# EAGLE design ver1 (EAGLE 6.1)
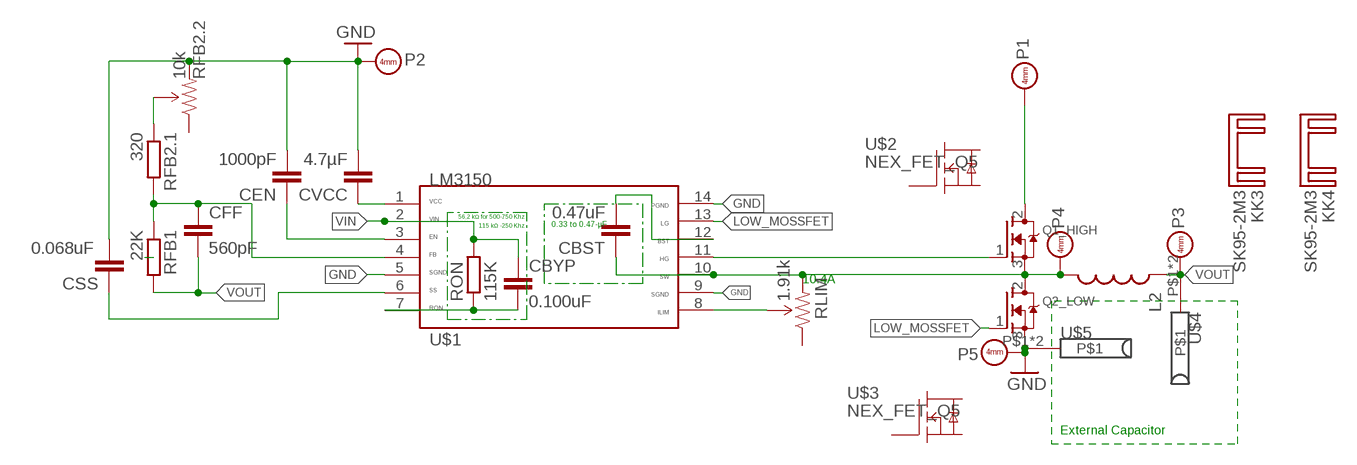
[diagram p0: schematic, sheet 1]

## Parts
CBST  0.47uF  C0805  [0805]
CBYP  0.100uF  C0805  [0805]
CEN  1000pF  C0805  [0805]
CFF  560pF  C0805  [0805]
CSS  0.068uF  C0805  [0805]
CVCC  4.7µF  C0805  [0805]
KK3  SK95-2M3  [SK95-2M3]
KK4  SK95-2M3  [SK95-2M3]
L2  INDUCTOR  [INDUCTOR-SRP4020]
P1  BANANA  [BANANA]
P2  BANANA  [BANANA]
P3  BANANA  [BANANA]
P4  BANANA  [BANANA]
P5  BANANA  [BANANA]
Q1_HIGH  MOSFET-NGDS_TO220V  [TO220V]
Q2_LOW  MOSFET-NGDS_TO220V  [TO220V]
RFB1  22K  RESISTORR805-0805  [R805]
RFB2.1  320  RESISTORR805-0805  [R805]
RFB2.2  10k  TRIMPOT3362U-2  [3362U-2]
RLIM  1.91k  TRIMPOT3362U-2  [3362U-2]
RON  115K  RESISTORR805-0805  [R805]
U$1  LM3150  [HTSSOP14]
U$2  NEX_FET_Q5  [Q5]
U$3  NEX_FET_Q5  [Q5]
U$4  BANANA  [BANANA]
U$5  BANANA  [BANANA]

## Nets
GND: CEN.2 CSS.2 CVCC.2 P2.P$1 P5.P$1 Q2_LOW.3(S) RFB2.2.3(CW) U$1.5 U$1.9 U$1.14 U$5.P$1 U$5.P$2
HIGH_MOSSFET: Q1_HIGH.1(G) U$1.11
LOW_MOSSFET: Q2_LOW.1(G) U$1.13
N$1: CVCC.1 U$1.1
N$2: CBYP.2 RON.1 U$1.7
N$3: CEN.1 U$1.3
N$4: CSS.1 U$1.6
N$5: CFF.1 RFB1.1 RFB2.1.2 U$1.4
N$6: RFB2.1.1 RFB2.2.2(WIPER)
N$7: CBST.2 U$1.12
N$11: RLIM.2(WIPER) U$1.8
N$13: CBST.1 L2.P$2 P4.P$1 Q1_HIGH.3(S) Q2_LOW.2(D) RLIM.3(CW) U$1.10
VIN: CBYP.1 P1.P$1 Q1_HIGH.2(D) RON.2 U$1.2
VOUT: CFF.2 L2.P$1 P3.P$1 RFB1.2
Unconnected: RFB2.2.1(CCW) RLIM.1(CCW) U$2.P$1(S) U$2.P$2(S) U$2.P$3(S) U$2.P$4(G) U$2.P$5(D) U$2.P$6(D) U$2.P$7(D) U$2.P$8(D) U$3.P$1(S) U$3.P$2(S) U$3.P$3(S) U$3.P$4(G) U$3.P$5(D) U$3.P$6(D) U$3.P$7(D) U$3.P$8(D) U$4.P$1 U$4.P$2

## Notes on the sheet
- 56,2 kΩ for 500-750 Khz
- 0.33 to 0.47-µF
- 115 kΩ -250 Khz
- 10.4A
- External Capacitor

## Library data of the parts
CBST CBYP CEN CFF CSS CVCC = adi_v1.6:C: SMD capacitor 0603 0805 1206
KK3 KK4 = heatsink:SK95-2M3: HEATSINK manufacturer Fischer/distributor Buerklin
L2 = SparkFun-Passives:INDUCTOR: Inductors Basic Inductor/Choke - 0603 and 1206. Footprints are not proven and vary greatly between part numbers. INDUCTOR POWER 3.3UH 4.0A SMD 0.197" L x 0.197" W x 0.177" H (5.00mm x 5.00mm x 4.50mm)
P1-P5 = adi_v1.6:BANANA
Q1_HIGH Q2_LOW = adafruit:MOSFET-N: N-Channel Mosfet 2N7002E - 60V 260mA SOT23 [Digikey: 2N7002ET1GOSTR-ND] - REEL BSH103 - 30V 850mA SOT23 [Digikey: 568-5013-1-ND]
RFB1 RFB2.1 RON = dp_devices:RESISTOR
RFB2.2 RLIM = SparkFun-Electromechanical:TRIMPOT: Various small potentiometers for "set-and-forget" applications
U$1 = TI_MSP430_v16:LM3150
U$2 U$3 = Serghei IR station:NEX_FET_Q5
U$4 U$5 = H_bridge_library:BANANA

## Board
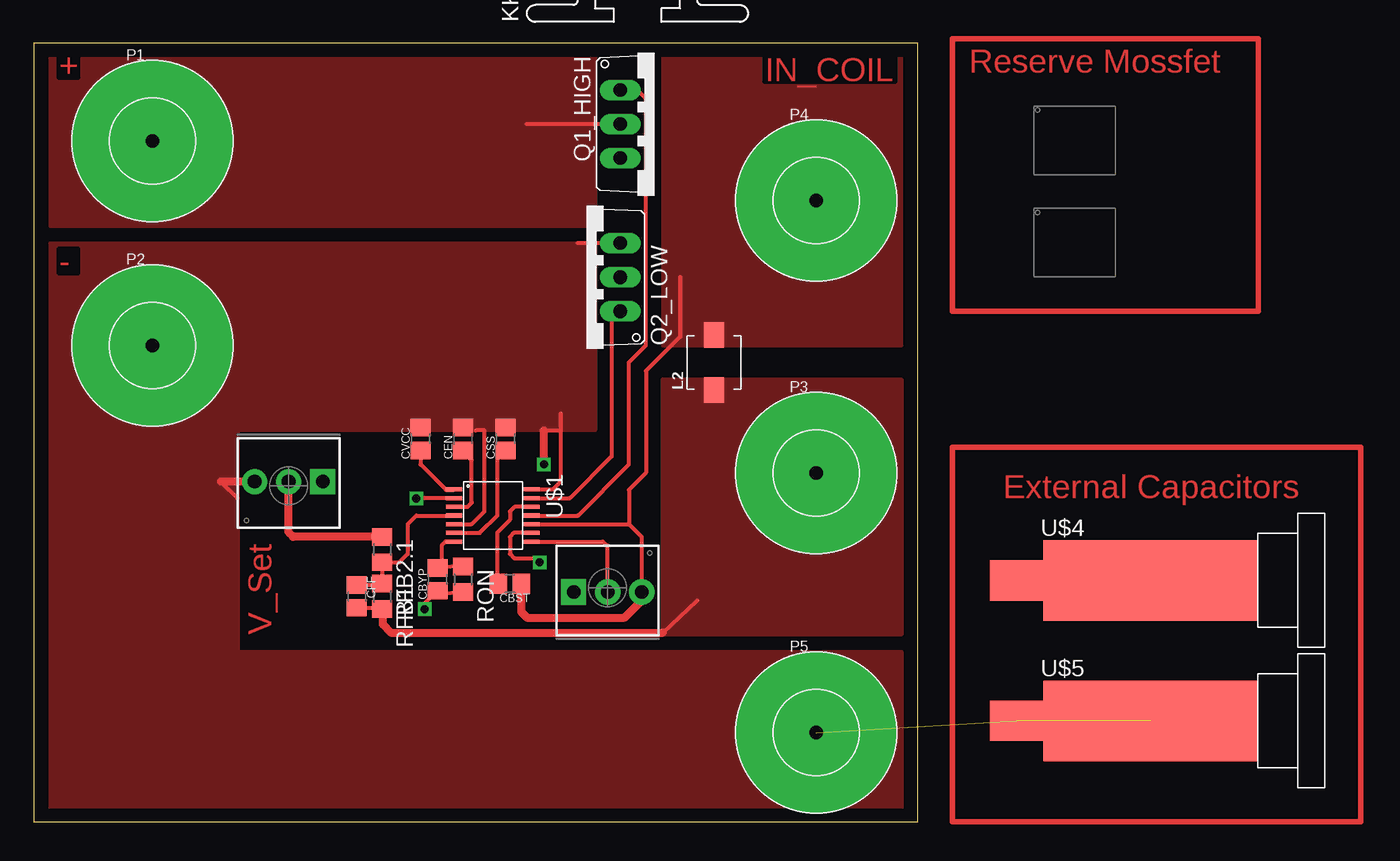
[diagram p1: board, top side]
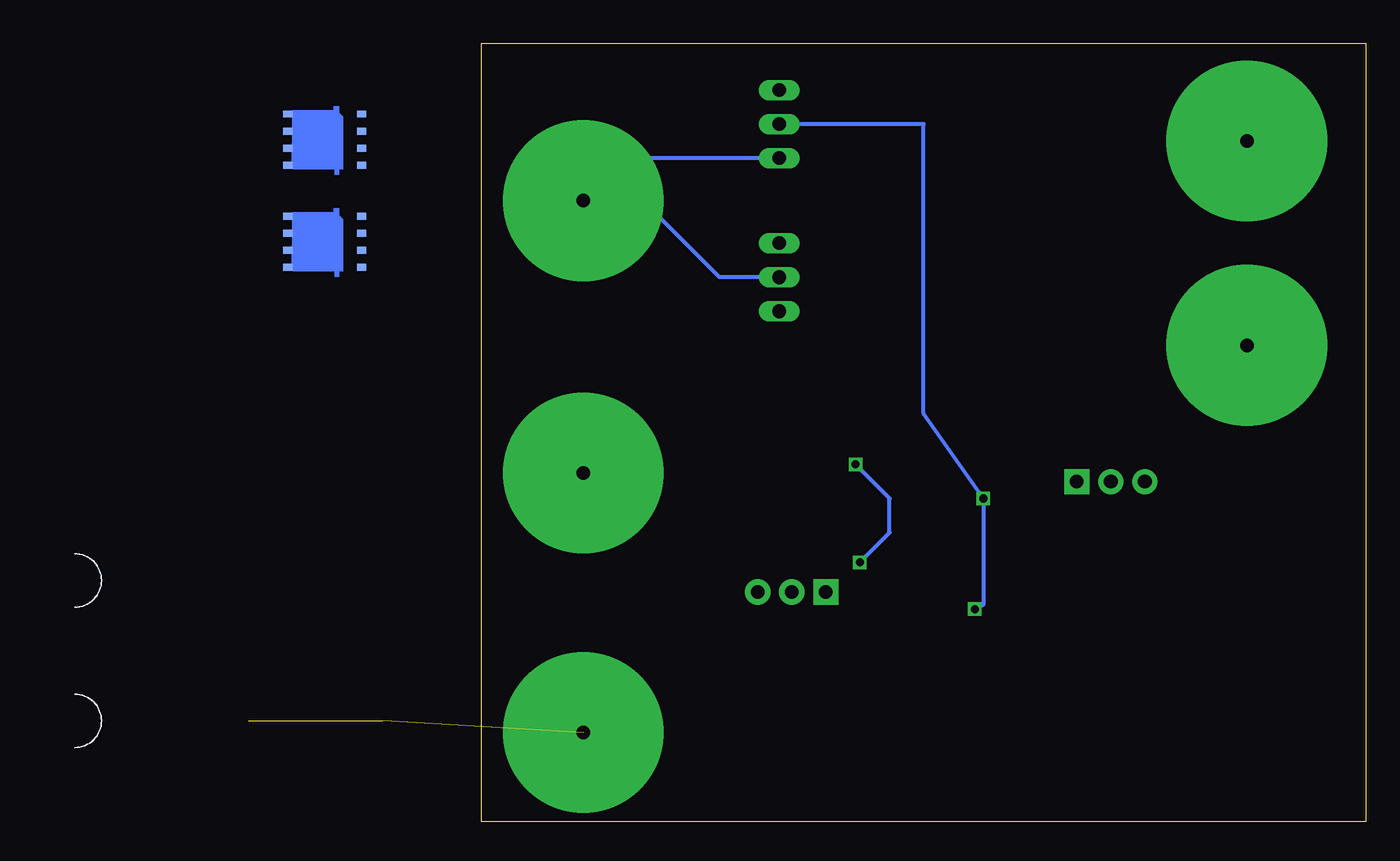
[diagram p2: board, bottom side, seen from below]

Size 66.02 x 58.09 mm. Coordinates in mm from the lower left corner, seen from the top.
Outline: 0,0 66.02,0 66.02,58.09 0,58.09 0,0
Copper layers (1*16): Top 0.035mm / dielectric 1.5mm / Bottom 0.035mm
Design rules: minimum track width 10mil, minimum drill 24mil, track to track 8mil, track to pad 8mil, pad to pad 8mil, via to via 8mil, smd to smd 8mil, copper to edge 40mil, drill to drill 8mil, minimum pad ring 10mil, minimum via ring 8mil, stop-mask expansion 4mil, vias tented up to drill 0mil, thermal gap 10mil

### Footprints (pad centres in the part's own frame; a part is rotated, then mirrored left to right if it is on the bottom)
0805 = smd 1.3 x 1.5: 1 -0.85,0; 2 0.85,0
SK95-2M3 = hole 3.302: 0,2.54
INDUCTOR-SRP4020 = smd 1.9 x 1.5: P$1 -2.05,0; P$2 2.05,0
BANANA = drill 1 pad 12: P$1 0,0
TO220V = drill 1.016 long: 1 -2.54,-2.54; 2 0,-2.54; 3 2.54,-2.54
R805 = smd 1.3 x 1.5: 1 -0.95,0; 2 0.95,0
3362U-2 = drill 1.016 pad 1.88 square: 1 -2.54,-0.305 | drill 1.016 pad 1.88: 2 0,-0.305; 3 2.54,-0.305
HTSSOP14 = smd 0.3 x 1.2: 1 -1.95,-2.9; 2 -1.3,-2.9; 3 -0.65,-2.9; 4 0,-2.9; 5 0.65,-2.9; 6 1.3,-2.9; 7 1.95,-2.9; 8 1.95,2.9; 9 1.3,2.9; 10 0.65,2.9; 11 0,2.9; 12 -0.65,2.9; 13 -1.3,2.9; 14 -1.95,2.9
Q5 = smd 0.7 x 0.5 bottom: P$1 -2.5,2.01; P$2 -2.5,0.74; P$3 -2.5,-0.53; P$4 -2.5,-1.8; P$5 3,-1.8; P$6 3,-0.53; P$7 3,0.74; P$8 3,2.01
BANANA' = smd 16 x 6: P$1 0.84,-0.08 | smd 4 x 3: P$2 -9.16,-0.08

### Placement (x,y rotation side)
CBST  35.56,17.78 180 top
CBYP  30.16,18.1 90 top
CEN  32.07,28.57 90 top
CFF  24.13,16.83 270 top
CSS  35.24,28.57 90 top
CVCC  28.89,28.57 90 top
KK3  48.26,66.04 270 top  (outside the outline)
KK4  41.91,66.04 90 top  (outside the outline)
L2  50.8,34.29 90 top
P1  8.89,50.8 0 top
P2  8.89,35.56 0 top
P3  58.42,26.04 0 top
P4  58.42,46.35 0 top
P5  58.42,6.67 0 top
Q1_HIGH  46.35,52.07 270 top
Q2_LOW  41.27,40.64 90 top
RFB1  26.04,16.83 270 top
RFB2.1  26.04,20.32 270 top
RFB2.2  19.05,25.08 180 top
RLIM  42.86,17.46 0 top
RON  32.07,18.1 270 top
U$1  34.29,22.86 270 top
U$2  77.47,43.18 0 top  (outside the outline)
U$3  77.47,50.8 0 top  (outside the outline)
U$4  BANANA  [BANANA']  82.55,18.1 0 top  (outside the outline)
U$5  BANANA  [BANANA']  82.55,7.62 0 top  (outside the outline)

### Tracks (layer width: path | path; a pad name or v marks a point on that pad's centre or on a via)
GND  (via drill 0.6)  (2 unrouted)
  Top 0.305: U$1.14 38.78,24.81 39.37,25.4 39.37,29.21 | 39.37,29.21 39.37,30.48 | U$1.5 32.69,22.21 33.66,23.18 33.66,29.21 33.02,29.21 | 13.98,25.39 15.24,24.13 | Q2_LOW.3 40.64,43.18 | U$1.9 35.85,21.56 35.56,21.27 35.56,20 35.88,19.68 37.47,19.68 v37.78,19.37 | 38.1,29.21 39.37,29.21
  Top 0.61: RFB2.2.3 13.98,25.39 | v38.1,26.67 38.1,29.21
  Bottom 0.305: v37.78,19.37 35.56,21.59 35.56,24.13 v38.1,26.67
  pour Top (no thermals): 1.27,43.18 41.91,43.18 41.91,29.21 1.27,29.21
  pour Top (no thermals): 64.77,12.7 64.77,0.64 1.27,0.64 1.27,40.64 15.24,40.64 15.24,12.7
HIGH_MOSSFET
  Top 0.305: U$1.11 40.64,22.86 44.45,26.67 44.45,34.29 45.72,35.56 45.72,53.98 45.09,54.61 Q1_HIGH.1
LOW_MOSSFET
  Top 0.305: Q2_LOW.1 43.15,37.44 43.15,27.27 40.03,24.16 U$1.13
N$1
  Top 0.305: CVCC.1 28.89,26.67 30.8,24.77 31.34,24.77 U$1.1
N$2
  Top 0.305: RON.1 31.85,19.15 CBYP.2 30.48,19.27 30.48,20.64 30.75,20.91 U$1.7
N$3
  Top 0.305: U$1.3 32.4,23.51 32.7,23.81 32.7,26.99 32.07,27.62 CEN.1
N$4
  Top 0.305: CSS.1 34.61,27.09 34.61,22.86 33.31,21.56 U$1.6
N$5
  Top 0.305: U$1.4 28.57,22.86 27.94,22.23 27.94,20 27.31,19.37 RFB2.1.2 RFB1.1 25.93,17.68 CFF.1
N$6
  Top 0.305: RFB2.2.2 19.05,24.13
  Top 0.61: RFB2.1.1 19.37,21.27 19.05,21.59 RFB2.2.2
N$7
  Top 0.305: U$1.12 35.89,23.51 35.56,23.18 35.56,22.54 34.61,21.59 34.61,17.78 | 34.61,17.78 34.29,17.78 | CBST.2 34.61,17.78
N$8
  Top 0.406: 68.58,58.42 68.58,38.1 91.44,38.1 91.44,58.42 68.58,58.42
N$9
  Top 0.406: 68.58,27.94 99.06,27.94 99.06,0 68.58,0 68.58,27.94
N$11
  Top 0.305: RLIM.2 42.86,20.64 42.5,20.91 U$1.8
N$13
  Top 0.305: 48.26,40.64 48.26,36.2 45.72,33.66 45.72,26.04 44.45,24.77 44.45,22.23 44.47,22.21 | U$1.10 44.47,22.21 | 44.47,22.21 45.4,21.27 RLIM.3 45.41,17.48 | 45.4,16.51 45.4,17.14 | 45.4,17.14 45.4,17.46 45.41,17.48 | 45.41,17.48 45.4,17.14
  Top 0.61: CBST.1 36.41,15.66 36.83,15.24 44.13,15.24 45.4,16.51
  Bottom 0.305: Q1_HIGH.3 57.15,49.53 | 57.15,49.53 P4.P$1 | Q2_LOW.2 48.26,40.64 57.15,49.53
  pour Top (no thermals): 46.99,57.15 46.99,35.56 64.77,35.56 64.77,57.15
VIN  (via drill 0.6)
  Top 0.305: Q1_HIGH.2 36.83,52.07 | RON.2 30.26,17.04 CBYP.1 29.21,16.3 v29.21,15.88 | U$1.2 29.18,24.16 v28.57,24.13
  Bottom 0.305: v29.21,15.88 28.57,16.19 v28.57,24.13 33.02,30.48 33.02,52.07 Q1_HIGH.2
  pour Top (no thermals): 1.27,57.15 41.91,57.15 41.91,44.45 1.27,44.45
VOUT
  Top 0.305: CFF.2 25.93,15.98 RFB1.2 | 46.99,14.13 49.53,16.51
  Top 0.61: RFB1.2 26.07,14.73 26.67,14.13 46.99,14.13
  pour Top (no thermals): 46.99,33.02 64.77,33.02 64.77,13.97 46.99,13.97

### Text on the board
Top: + | Reserve Mossfet | IN_COIL | - | External Capacitors | V_Set